# EAGLE design RotaryConnector_R (EAGLE 9.6.2)
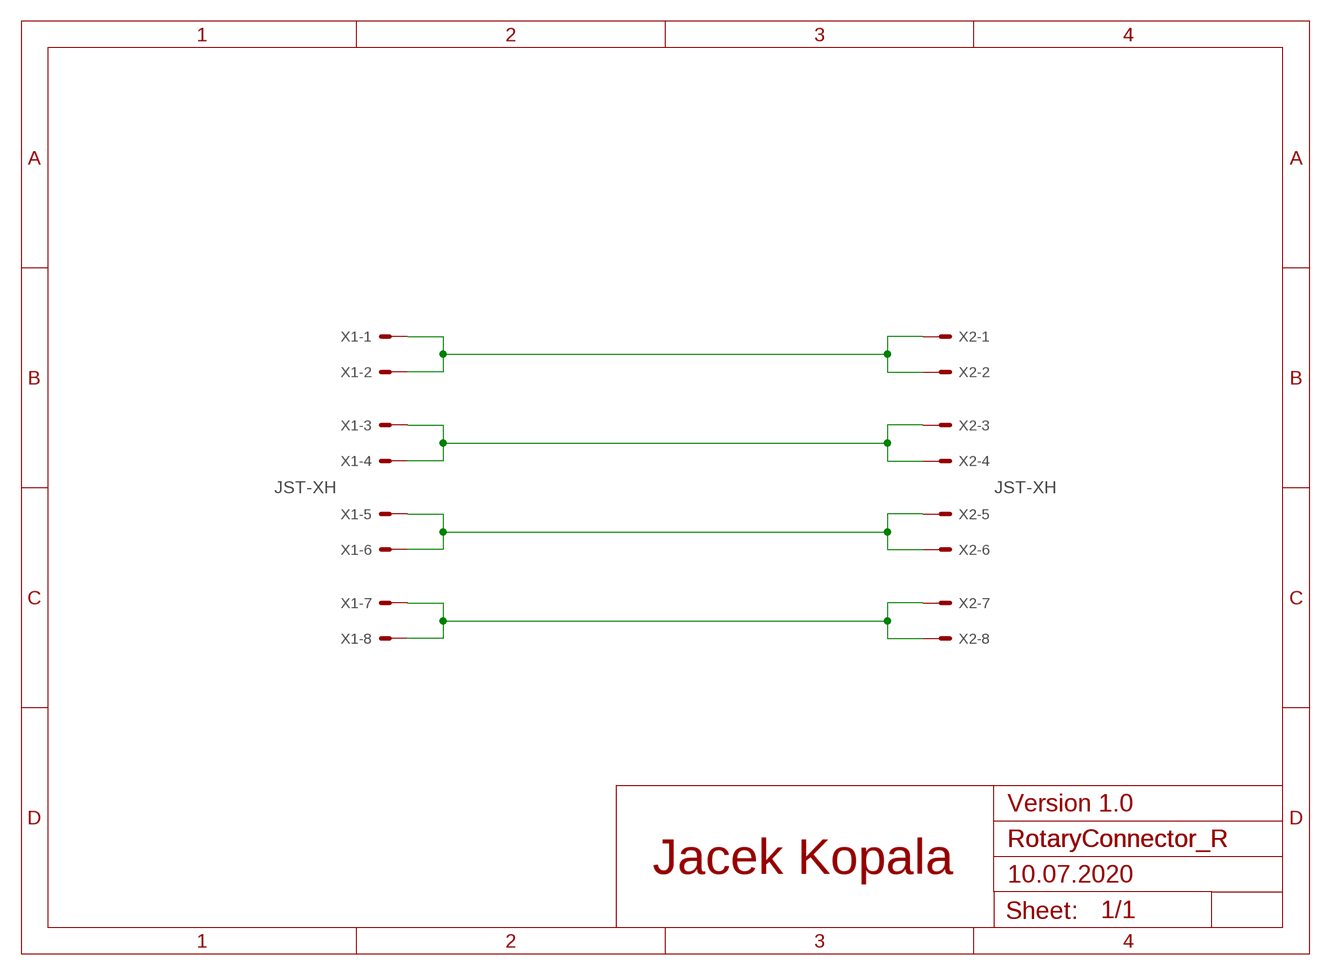
[diagram p0: schematic, sheet 1]

## Parts
X1  JST-XH  JST-XH-08-PIN-LONG-PAD  [JST-XH-08-PACKAGE-LONG-PAD]
X2  JST-XH  JST-XH-08-PIN-LONG-PAD  [JST-XH-08-PACKAGE-LONG-PAD]

## Nets
SIG1: X1.1 X1.2 X2.1 X2.2
SIG2: X1.3 X1.4 X2.3 X2.4
SIG3: X1.5 X1.6 X2.5 X2.6
SIG4: X1.7 X1.8 X2.7 X2.8

## Notes on the sheet
- Version 1.0
- RotaryConnector_R
- Jacek Kopala
- 10.07.2020

## Library data of the parts
X1 X2 = con-JST XH:JST-XH-08-PIN: JST XH Connector 2 Pin Wire to board connector. Pitch: 2,54 mm, (0.100") Number of pins: 8 Created by Rembrandt Electronics www.rembrandtelectronics.com

## Board
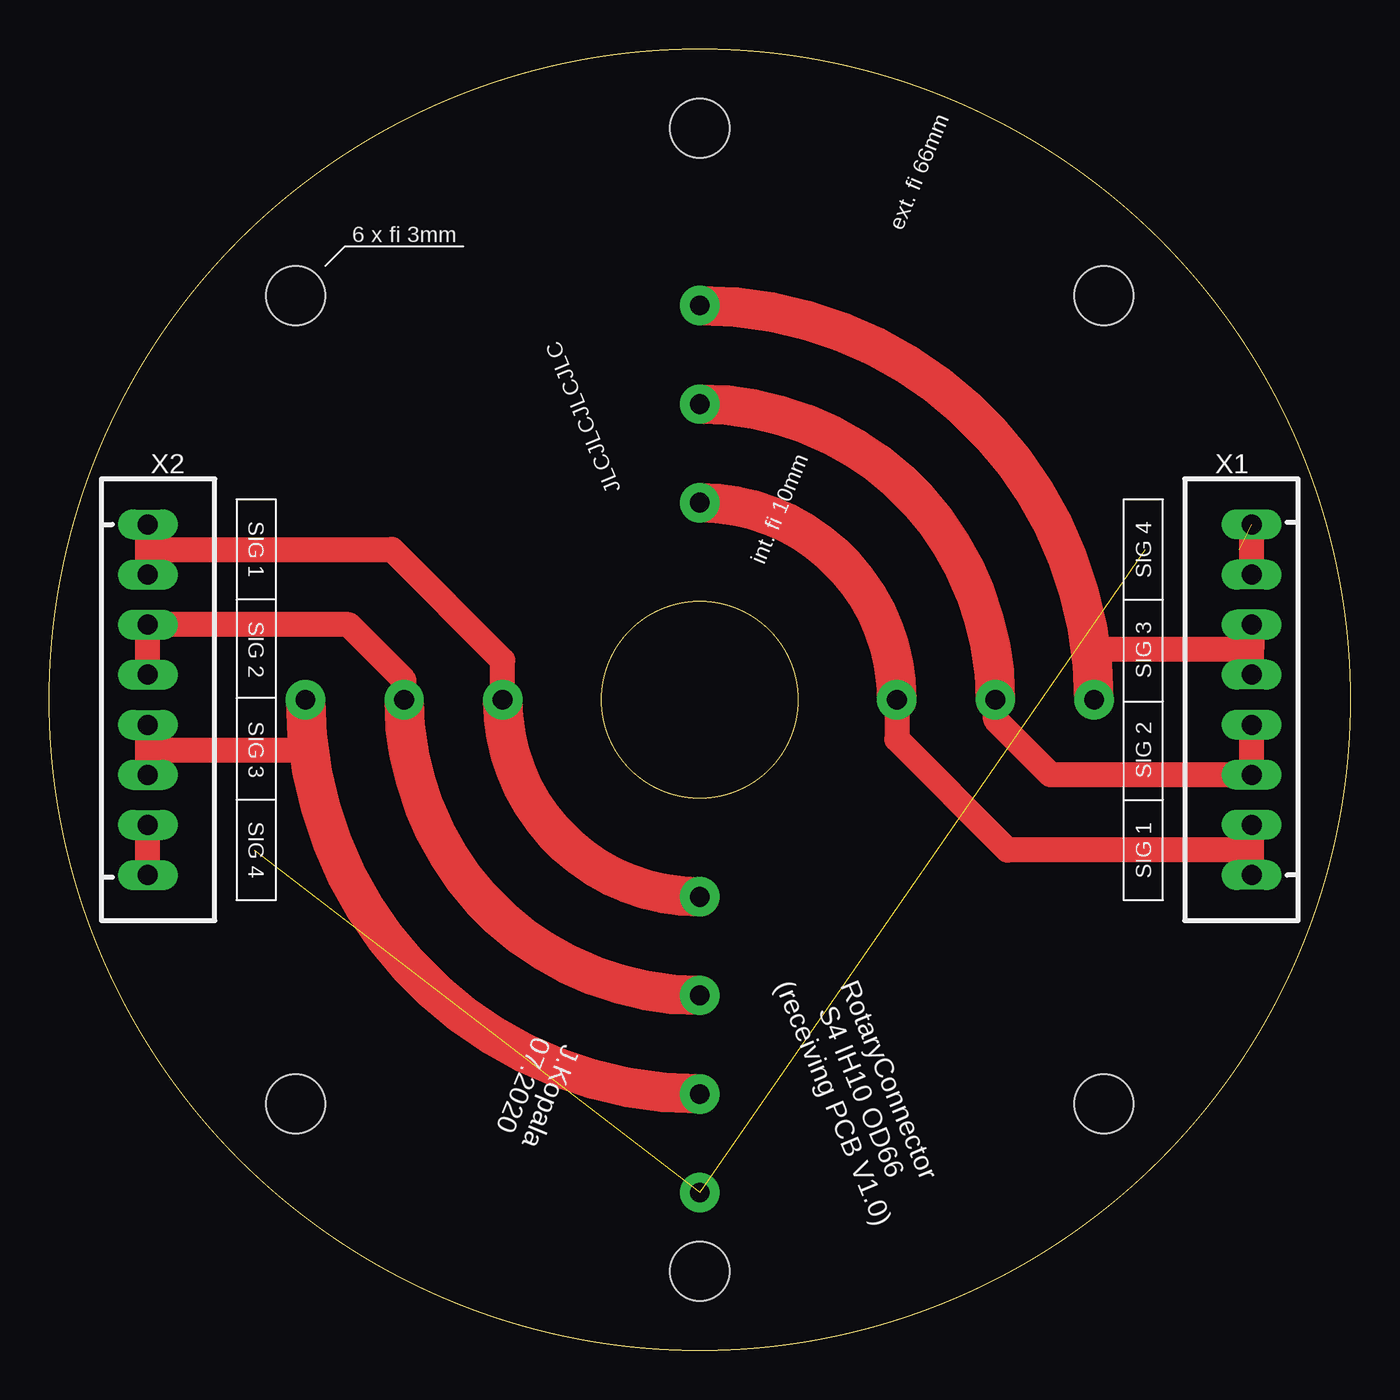
[diagram p1: board, top side]
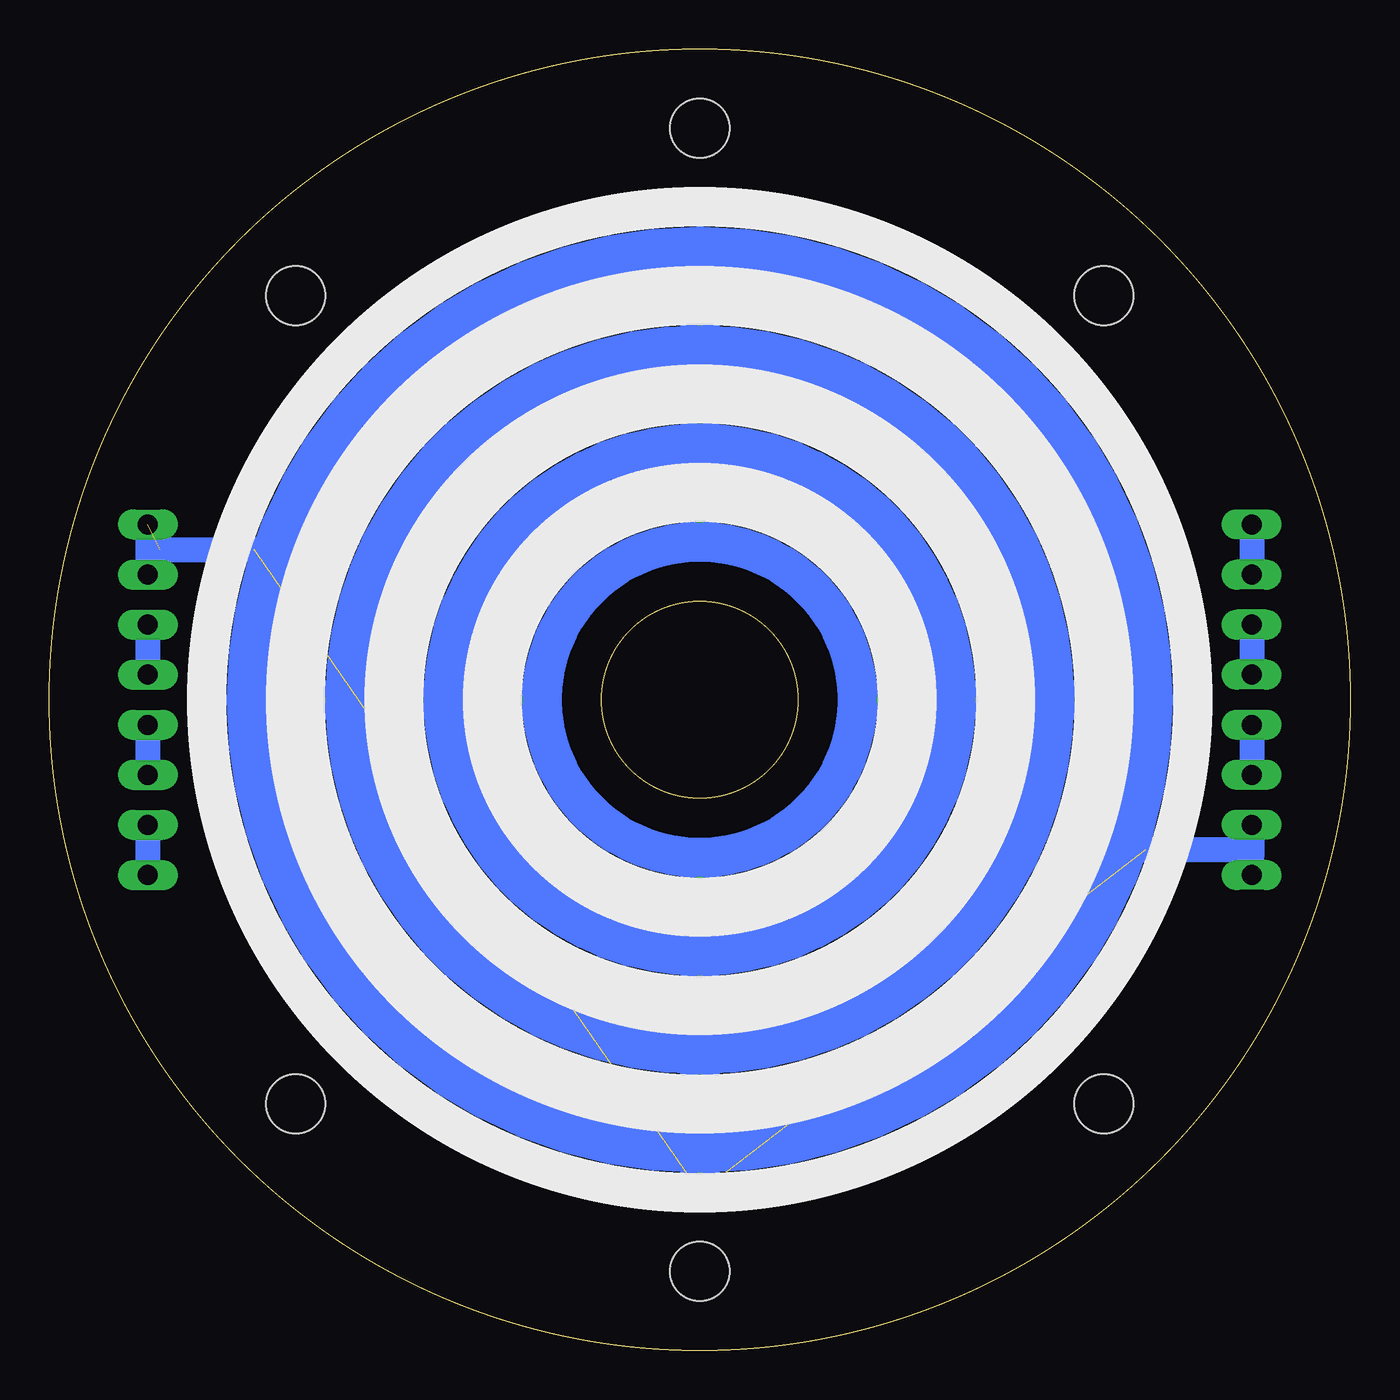
[diagram p2: board, bottom side, seen from below]

Size 66 x 66 mm. Coordinates in mm from the lower left corner, seen from the top.
Outline: circle at 33,33 radius 5
Outline: circle at 33,33 radius 33
Copper layers (1*16): Top 0.035mm / dielectric 1.5mm / Bottom 0.035mm
Design rules "default": minimum track width 6mil, minimum drill 0.35mm, track to track 6mil, track to pad 6mil, pad to pad 6mil, via to via 6mil, smd to smd 6mil, copper to edge 40mil, drill to drill 6mil, minimum pad ring 10mil, minimum via ring 8mil, stop-mask expansion 4mil, vias tented up to drill 0mil, thermal gap 10mil
Holes 3 mm at 33,4 33,62 12.49,53.51 53.51,53.51 12.49,12.49 53.51,12.49

### Footprints (pad centres in the part's own frame; a part is rotated, then mirrored left to right if it is on the bottom)
JST-XH-08-PACKAGE-LONG-PAD = drill 1.016 long: 1 -8.89,0; 2 -6.35,0; 3 -3.81,0; 4 -1.27,0; 5 1.27,0; 6 3.81,0; 7 6.35,0; 8 8.89,0

### Placement (x,y rotation side)
X1  61,33 90 top
X2  5,33 270 top

### Tracks (layer width: path | path; a pad name or v marks a point on that pad's centre or on a via)
SIG1  (via drill 1 pad 2)
  Top 1.27: X1.1 61,25.38 | 61,25.38 X1.2 | X2.2 5,40.62 | 5,40.62 X2.1 | 5,40.62 17.38,40.62 23,35 v23,33 | 61,25.38 48.62,25.38 43,31 v43,33
  Top 2: v33,23 arc-90 v23,33 | v33,43 arc-90 v43,33
  Bottom 1.27: X1.2 X1.1 | X2.1 X2.2
  Bottom 2: 33,41 arc90 25,33 | 25,33 arc90 33,25 | 33,25 arc90 41,33 | 41,33 arc90 33,41 | 33,25 v33,23 | 33,41 v33,43 | 25,33 v23,33 | 41,33 v43,33
SIG2  (via drill 1 pad 2)
  Top 1.27: X1.4 X1.3 50.81,29.19 48,32 v48,33 | X2.4 X2.3 15.19,36.81 18,34 v18,33
  Top 2: v33,18 arc-90 v18,33 | v33,48 arc-90 v48,33
  Bottom 1.27: X1.4 X1.3 | X2.3 X2.4
  Bottom 2: 33,46 arc-90 46,33 | 46,33 arc-90 33,20 | 33,46 arc90 20,33 | 20,33 arc90 33,20 | 33,46 v33,48 | 33,20 v33,18 | 46,33 v48,33 | 20,33 v18,33
SIG3  (via drill 1 pad 2)
  Top 1.27: X1.5 61,35.54 | X1.6 61,35.54 | X2.6 5,30.46 | 5,30.46 X2.5 | v13,33 13,30.46 5,30.46 | 61,35.54 53,35.54 v53,33
  Top 2: v33,13 arc-90 v13,33 | v33,53 arc-90 v53,33
  Bottom 1.27: X1.6 X1.5 | X2.5 X2.6
  Bottom 2: 33,51 arc-90 51,33 | 51,33 arc-90 33,15 | 33,51 arc90 15,33 | 15,33 arc90 33,15 | 33,51 v33,53 | 33,15 v33,13 | 51,33 v53,33 | 15,33 v13,33
SIG4  (via drill 1 pad 2)  (3 unrouted)
  Top 1.27: X1.7 X1.8 | X2.8 X2.7
  Bottom 1.27: X1.8 X1.7 | X2.7 5,25 | X2.8 5,25 | 5,25 5.38,25.38 10.39,25.38 | 60.38,40.62 55.61,40.62
  Bottom 2: 33,10 arc180 33,56 arc180 33,10 | 33,10 v33,8

### Text on the board
tPlace: ext. fi 66mm | 6 x fi 3mm | JLCJLCJLCJLC | int. fi 10mm | SIG 1 | SIG 4 | SIG 2 | SIG 3 | SIG 3 | SIG 2 | SIG 4 | SIG 1 | J.Kopala / 07.2020 | RotaryConnector / S4 IH10 OD66 / (receiving PCB V1.0)